# EAGLE board F5529LP_node (EAGLE 7.2.0), part 1 of 2
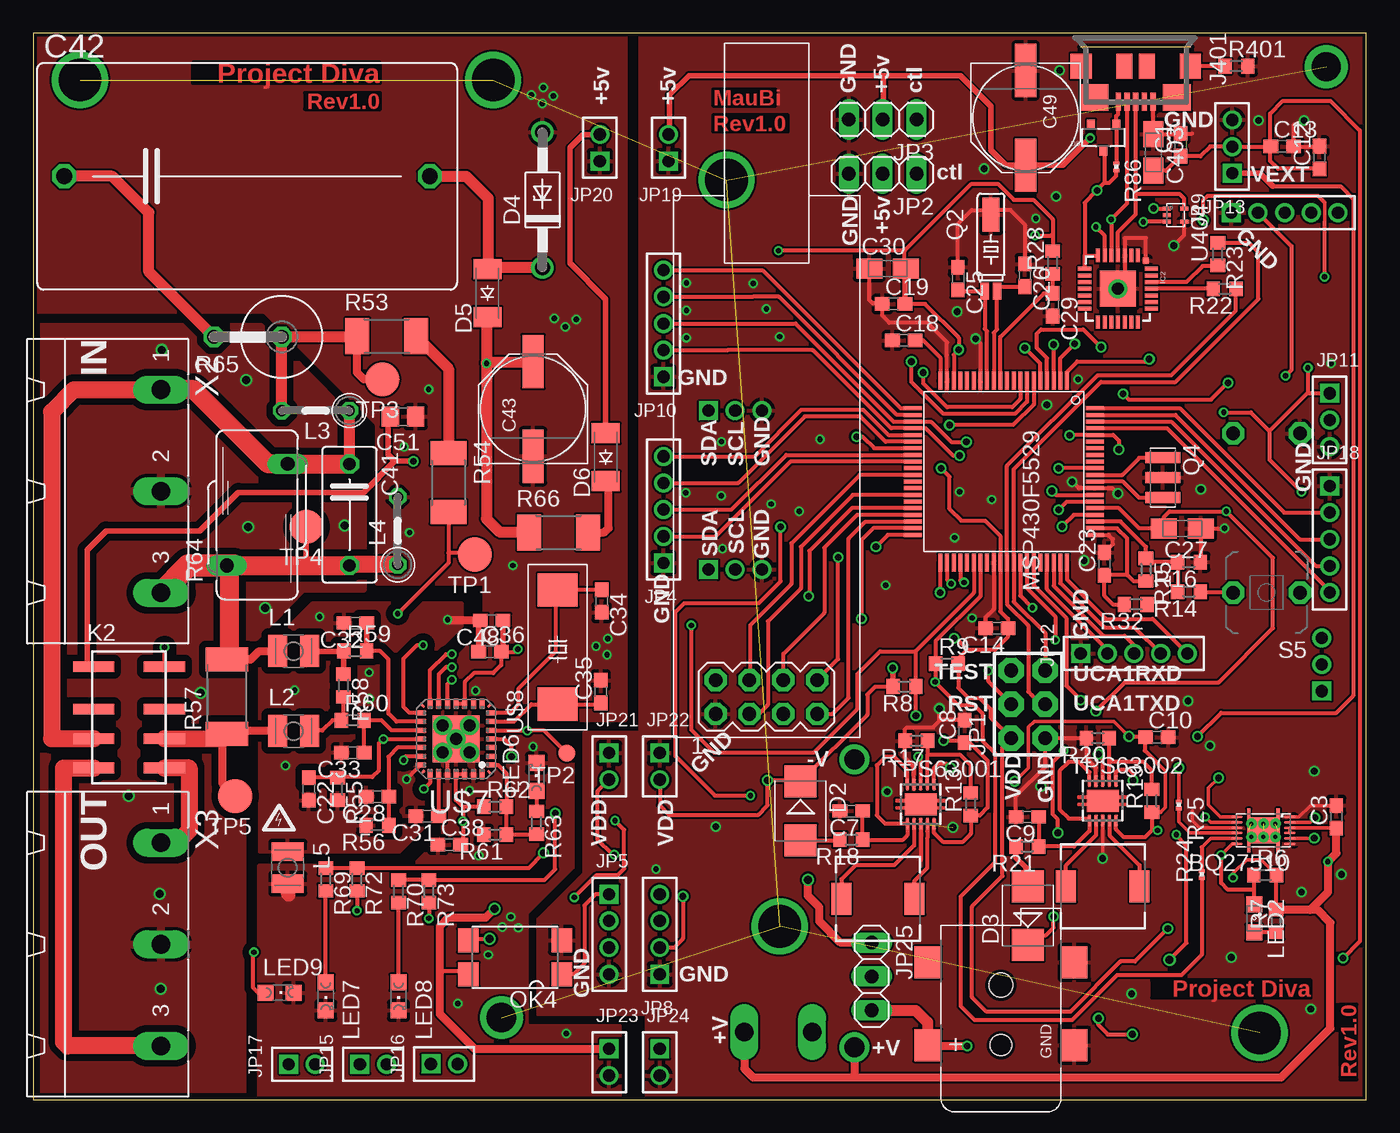
[diagram p2: board, top side]
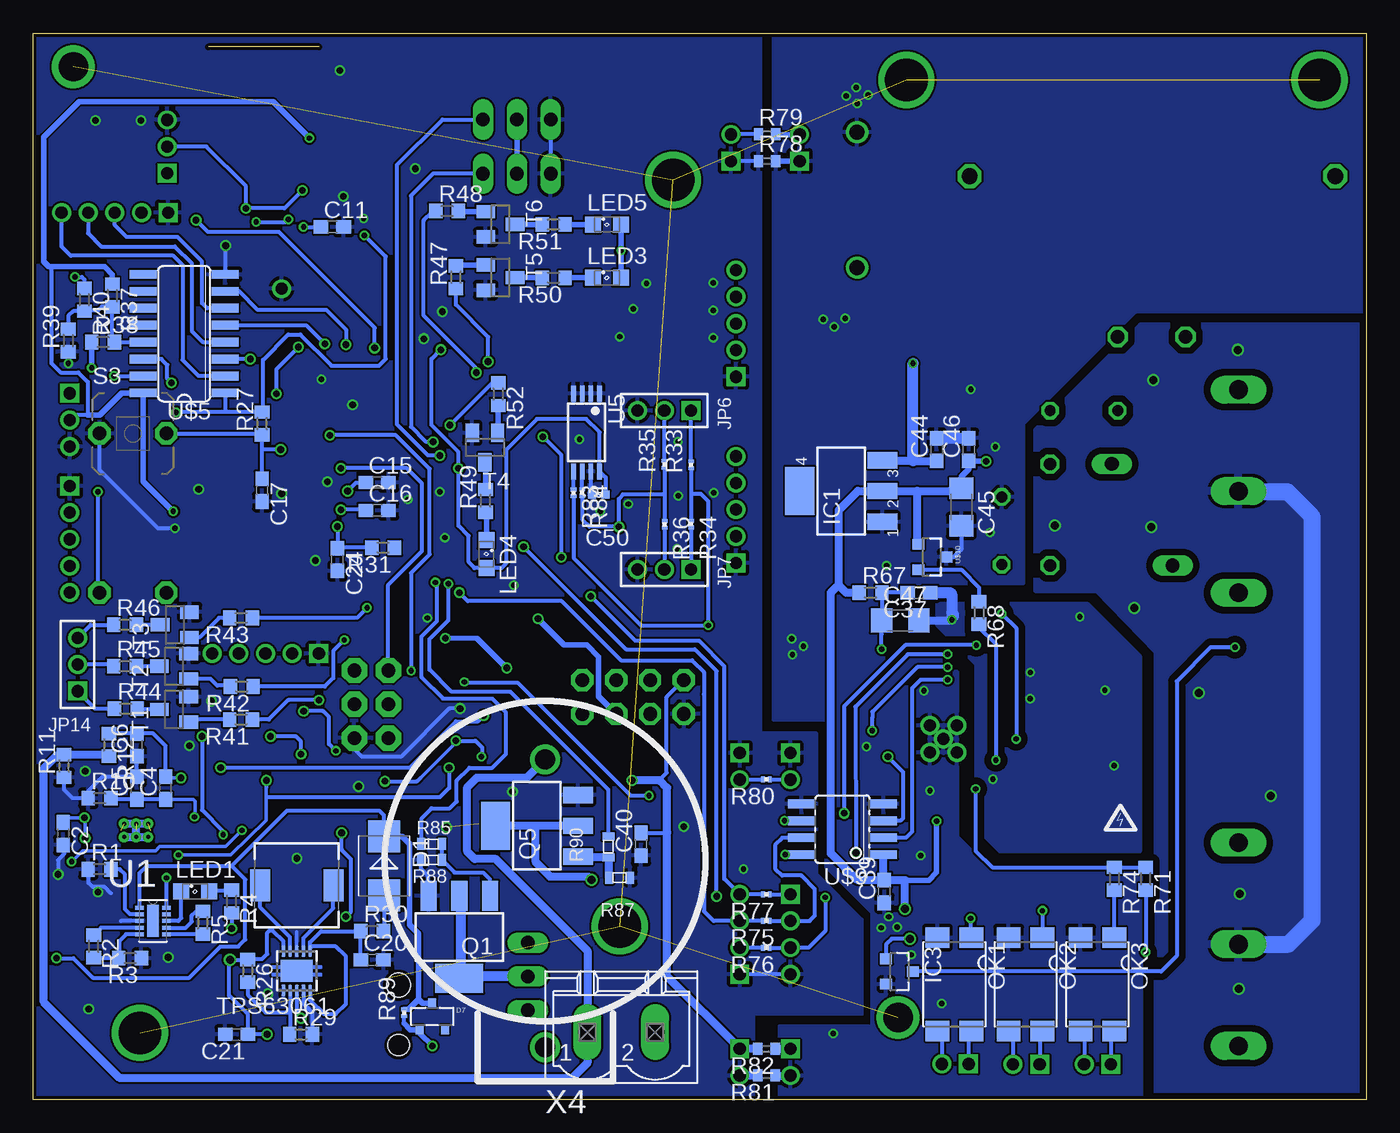
[diagram p3: board, bottom side, seen from below]

Size 100 x 80 mm. Coordinates in mm from the lower left corner, seen from the top.
Outline: 0,0 100,0 100,80 0,80 0,0
Copper layers (1*16): Top 0.035mm / dielectric 1.5mm / Bottom 0.035mm
Design rules "Elecrow_2-layer_eagle_rule": minimum track width 6mil, minimum drill 12mil, track to track 6mil, track to pad 6mil, pad to pad 6mil, via to via 6mil, smd to smd 0mil, copper to edge 10mil, drill to drill 10mil, minimum pad ring 10mil, minimum via ring 6mil, stop-mask expansion 2mil, vias tented up to drill 100mil, thermal gap 10mil
Net classes: 0 default: width 0.254 mm; 1 Ground: width 0.1 mm, drill 0.2 mm; 2 Power: width 0.203 mm, drill 0.305 mm, clearance 0.152 mm to class 0, clearance 0.152 mm to class 1, clearance 0.152 mm

## Footprints (pad centres in the part's own frame; a part is rotated, then mirrored left to right if it is on the bottom)
DRZ = smd 0.85 x 0.2: 1 -1.975,1; 2 -1.975,0.6; 3 -1.975,0.2; 4 -1.975,-0.2; 5 -1.975,-0.6; 6 -1.975,-1; 7 1.975,-1; 8 1.975,-0.6; 9 1.975,-0.2; 10 1.975,0.2; 11 1.975,0.6; 12 1.975,1 | smd 2.45 x 1.95: EXP@1 0,0 | smd 0.25 x 3.3: EXP@2 -1.1,0; EXP@3 1.1,0 | drill 0.3 pad 0.406: EXP@4 -0.9,0.5; EXP@5 0,0.5; EXP@6 0.9,0.5; EXP@7 -0.9,-0.5; EXP@8 0,-0.5; EXP@9 0.9,-0.5
C0603 = smd 1.1 x 1: 1 -0.85,0; 2 0.85,0
A/3216-18R = smd 1.95 x 1.5: + 1.375,0; - -1.375,0
C075-042X103 = drill 0.914 octagon: 1 -3.81,0; 2 3.81,0
C275-173X316 = drill 1.194 octagon: 1 -13.716,0; 2 13.716,0
PANASONIC_F = smd 4 x 1.6: + 3.55,0; - -3.55,0
C1206 = smd 1.6 x 1.8: 1 -1.4,0; 2 1.4,0
0402 = smd 0.6 x 0.6: 1 -0.501,0; 2 0.501,0
C0805 = smd 1.3 x 1.5: 1 -0.95,0; 2 0.95,0
DCJACK_2MM_SMT = smd 2.4 x 2: GND 0,-5.5; GNDBREAK 6.2,-5.5; PWR1 0,5.5; PWR2 6.2,5.5 | hole 1.6: 0,0 | hole 1.8: 4.5,0
DIODE_SMB = smd 2.4 x 2.4: A 2.2,0; C -2.2,0
DO41Z10 = drill 1.118: A 5.08,0; C -5.08,0
SOD-123_MINI-SMA = smd 1.5 x 2.1: A 1.8,0; C -1.8,0
SOT23-R = smd 0.6 x 0.7: 1 -0.95,-1; 2 0.95,-1; 3 0,1
SOT223 = smd 1.219 x 2.235: 1 -2.311,-3.099; 2 0,-3.099; 3 2.311,-3.099 | smd 3.6 x 2.2: 4 0,3.099
MLP28 = smd 1 x 0.3: 1 -2.5,1.5; 2 -2.5,1; 3 -2.5,0.5; 4 -2.5,0; 5 -2.5,-0.5; 6 -2.5,-1; 7 -2.5,-1.5; 15 2.5,-1.5; 16 2.5,-1; 17 2.5,-0.5; 18 2.5,0; 19 2.5,0.5; 20 2.5,1; 21 2.5,1.5 | smd 0.3 x 1: 8 -1.5,-2.5; 9 -1,-2.5; 10 -0.5,-2.5; 11 0,-2.5; 12 0.5,-2.5; 13 1,-2.5; 14 1.5,-2.5; 22 1.5,2.5; 23 1,2.5; 24 0.5,2.5; 25 0,2.5; 26 -0.5,2.5; 27 -1,2.5; 28 -1.5,2.5 | smd 2.7 x 2.7: EXP 0,0 | drill 0.9: EXP@0 0,0 | smd 0.435 x 0.435: M -2.103,2.103
SOT23 = smd 0.8 x 0.9: 1 -0.95,-1; 2 0.95,-1; 3 0,1
HIROSE-ZX62R-B-5P = smd 1.35 x 0.4: D+ 2.675,0; D- 2.675,-0.65; GND 2.675,1.3; NC 2.675,0.65; VBUS 2.675,-1.3 | smd 1.9 x 1.6: SHIELD1 0,4.1; SHIELD2 0,-4.1 | smd 2 x 2.1: SHIELD3 2.35,3.1; SHIELD4 2.35,-3.1 | smd 1.9 x 1.2: SHIELD5 0,0.85; SHIELD6 0,-0.85
2X03 = drill 1.016 pad 1.905 octagon: 1 -2.54,-1.27; 2 -2.54,1.27; 3 0,-1.27; 4 0,1.27; 5 2.54,-1.27; 6 2.54,1.27
1X03 = drill 1.016 long: 1 -2.54,0; 2 0,0; 3 2.54,0
1X05M = drill 0.914 square: 1 -4,0 | drill 0.914: 2 -2,0; 3 0,0; 4 2,0; 5 4,0
1X04M = drill 0.914 square: 1 -3,0 | drill 0.914: 2 -1,0; 3 1,0; 4 3,0
1X03M = drill 0.914 square: 1 -2,0 | drill 0.914: 2 0,0; 3 2,0
1X02M = drill 0.914 square: 1 -1,0 | drill 0.914: 2 1,0
FTR-B4G = smd 0.8 x 3.1: 1 -3.8,-2.65; 2 -0.6,-2.65; 3 1.6,-2.65; 4 3.8,-2.65; 5 3.8,2.65; 6 1.6,2.65; 7 -0.6,2.65; 8 -3.8,2.65
L2825P = smd 1.4 x 2.4: 1 -1.2,0; 2 1.2,0
0207/5V = drill 0.813 octagon: 1 -2.54,0; 2 2.54,0
SML0805 = smd 1.2 x 1.2: A 1.05,0; C -1.05,0
CHIPLED_0805 = smd 1.2 x 1.2: A 0,-1.05; C 0,1.05
PN80 = smd 1.35 x 0.3: 1 -6.825,4.75; 2 -6.825,4.25; 3 -6.825,3.75; 4 -6.825,3.25; 5 -6.825,2.75; 6 -6.825,2.25; 7 -6.825,1.75; 8 -6.825,1.25; 9 -6.825,0.75; 10 -6.825,0.25; 11 -6.825,-0.25; 12 -6.825,-0.75; 13 -6.825,-1.25; 14 -6.825,-1.75; 15 -6.825,-2.25; 16 -6.825,-2.75; 17 -6.825,-3.25; 18 -6.825,-3.75; 19 -6.825,-4.25; 20 -6.825,-4.75; 41 6.825,-4.75; 42 6.825,-4.25; 43 6.825,-3.75; 44 6.825,-3.25; 45 6.825,-2.75; 46 6.825,-2.25; 47 6.825,-1.75; 48 6.825,-1.25; 49 6.825,-0.75; 50 6.825,-0.25; 51 6.825,0.25; 52 6.825,0.75; 53 6.825,1.25; 54 6.825,1.75; 55 6.825,2.25; 56 6.825,2.75; 57 6.825,3.25; 58 6.825,3.75; 59 6.825,4.25; 60 6.825,4.75 | smd 0.3 x 1.35: 21 -4.75,-6.825; 22 -4.25,-6.825; 23 -3.75,-6.825; 24 -3.25,-6.825; 25 -2.75,-6.825; 26 -2.25,-6.825; 27 -1.75,-6.825; 28 -1.25,-6.825; 29 -0.75,-6.825; 30 -0.25,-6.825; 31 0.25,-6.825; 32 0.75,-6.825; 33 1.25,-6.825; 34 1.75,-6.825; 35 2.25,-6.825; 36 2.75,-6.825; 37 3.25,-6.825; 38 3.75,-6.825; 39 4.25,-6.825; 40 4.75,-6.825; 61 4.75,6.825; 62 4.25,6.825; 63 3.75,6.825; 64 3.25,6.825; 65 2.75,6.825; 66 2.25,6.825; 67 1.75,6.825; 68 1.25,6.825; 69 0.75,6.825; 70 0.25,6.825; 71 -0.25,6.825; 72 -0.75,6.825; 73 -1.25,6.825; 74 -1.75,6.825; 75 -2.25,6.825; 76 -2.75,6.825; 77 -3.25,6.825; 78 -3.75,6.825; 79 -4.25,6.825; 80 -4.75,6.825
NRF24L01_HP = drill 1.016 pad 1.676 octagon: 1 13.485,-5.74; 2 10.945,-5.74; 3 13.485,-3.2; 4 10.945,-3.2; 5 13.485,-0.66; 6 10.945,-0.66; 7 13.485,1.88; 8 10.945,1.88
SMD4 = smd 1.78 x 1.55: 1 -1.27,-3.5; 2 1.27,-3.5; 3 1.27,3.5; 4 -1.27,3.5
MS3V-T1R = smd 0.635 x 1.27: P1 -0.47,-4.43; P2 0.47,-4.43 | smd 1.27 x 2.54: P3 0,1.3
MURATA-FILTER_CSTCR = smd 0.8 x 2.6: 1 -1.5,0; 2 0,0; 3 1.5,0
R0603 = smd 1 x 1.1: 1 -0.85,0; 2 0.85,0
R0201 = smd 0.28 x 0.43: 1 -0.255,0; 2 0.255,0
R2010 = smd 1.8 x 2.7: 1 -2.2,0; 2 2.2,0
R2512 = smd 1.8 x 3.2: 1 -2.8,0; 2 2.8,0
S10K420 = drill 1.016 long: 1 -2.286,-3.81; 2 2.286,3.81
0617V = drill 1.016 octagon: 1 -2.54,0; 2 2.54,0
R0402 = smd 0.7 x 0.9: 1 -0.65,0; 2 0.65,0
0603 = smd 0.6 x 0.9: 1 -0.787,0; 2 0.787,0
PBTH = drill 1.016 pad 1.676 octagon: 1 -0.001,0.001; 2 5.001,0.001
SOT23' = smd 1 x 1.4: 1 -0.95,-1.1; 2 0.95,-1.1; 3 0,1.1
B2,54 = smd 2.54 x 2.54: TP 0,0
B1,27 = smd 1.27 x 1.27: TP 0,0
DRC-S-PVSON-N10 = smd 0.28 x 0.85: 1 -1,-1.475; 2 -0.5,-1.475; 3 0,-1.475; 4 0.5,-1.475; 5 1,-1.475; 6 1,1.475; 7 0.5,1.475; 8 0,1.475; 9 -0.5,1.475; 10 -1,1.475 | smd 2.4 x 1.65: TH 0,0
SON50P200X300X80-11N = smd 0.66 x 0.305: 1 -1.016,0.991; 2 -1.016,0.508; 3 -1.016,0; 4 -1.016,-0.508; 5 -1.016,-0.991; 6 1.016,-0.991; 7 1.016,-0.508; 8 1.016,0; 9 1.016,0.508; 10 1.016,0.991 | smd 0.838 x 2.388: 11 0,0
TSSOP8 = smd 1.2 x 0.35: 1 -2.925,0.975; 2 -2.925,0.325; 3 -2.925,-0.325; 4 -2.925,-0.975; 5 2.925,-0.975; 6 2.925,-0.325; 7 2.925,0.325; 8 2.925,0.975
TPD2E001-DRL = smd 0.3 x 0.6: 1 -0.5,-0.65; 2 0,-0.65; 3 0.5,-0.65; 4 0.5,0.65; 5 -0.5,0.65
CR2032 = drill 1.5: P$1 0,-13.97; P$2 0,7.62
B82462G = smd 2.4 x 1.5: P$1 0,2.75; P$2 0,-2.75
SOIC16 = smd 0.66 x 2.032: 1 -4.445,-3.073; 2 -3.175,-3.073; 3 -1.905,-3.073; 4 -0.635,-3.073; 5 0.635,-3.073; 6 1.905,-3.073; 7 3.175,-3.073; 8 4.445,-3.073; 9 4.445,3.073; 10 3.175,3.073; 11 1.905,3.073; 12 0.635,3.073; 13 -0.635,3.073; 14 -1.905,3.073; 15 -3.175,3.073; 16 -4.445,3.073
QFN28 = smd 0.8 x 0.4: 1 -2.65,1.95; 2 -2.65,1.3; 3 -2.65,0.65; 4 -2.65,0; 5 -2.65,-0.65; 6 -2.65,-1.3; 7 -2.65,-1.95; 15 2.65,-1.95; 16 2.65,-1.3; 17 2.65,-0.65; 18 2.65,0; 19 2.65,0.65; 20 2.65,1.3; 21 2.65,1.95 | smd 0.4 x 0.8: 8 -1.95,-2.65; 9 -1.3,-2.65; 10 -0.65,-2.65; 11 0,-2.65; 12 0.65,-2.65; 13 1.3,-2.65; 14 1.95,-2.65; 22 1.95,2.65; 23 1.3,2.65; 24 0.65,2.65; 25 0,2.65; 26 -0.65,2.65; 27 -1.3,2.65; 28 -1.95,2.65 | smd 3.55 x 3.55: M@0 0,0 | drill 0.9: M@1 -1.016,1.016; M@2 1.016,1.016; M@3 -1.016,-1.016; M@4 1.016,-1.016; M@5 0,0 | smd 0.17 x 0.4 rotated 45: R1 -2.525,2.525 | smd 0.17 x 0.4 rotated 135: R2 -2.525,-2.525 | smd 0.17 x 0.4 rotated 225: R3 2.525,-2.525 | smd 0.17 x 0.4 rotated 315: R4 2.5,2.5
FQ1045A = smd 2.5 x 3: 1 -4.128,0; 2 4.445,0
SOIC08 = smd 0.66 x 2.032: 1 -1.905,-3.073; 2 -0.635,-3.073; 3 0.635,-3.073; 4 1.905,-3.073; 5 1.905,3.073; 6 0.635,3.073; 7 -0.635,3.073; 8 -1.905,3.073
SOT23-3 = smd 0.8 x 0.9: 1 -0.95,-1; 2 0.95,-1; 3 0,1.1
GMSTBA3 = drill 1.397 long: 1 -7.62,5.08; 2 0,5.08; 3 7.62,5.08
MSTBV2 = drill 1.397 long: 1 -2.54,0; 2 2.54,0

## Placement (x,y rotation side)
BQ27510  BQ27510-G3  [DRZ]  92.3,20.19 180 top
C1  100n  [C0603]  86.07,71.63 90 top
C2  0.47u  [C0603]  97.76,19.94 270 bottom
C3  0.47u  [C0603]  97.76,21.21 90 top
C4  0.47u  [C0603]  90.07,23.37 90 bottom
C5  0.47u  [C0603]  92.23,23.37 90 bottom
C6  0.47u  [C0603]  92.23,26.61 90 bottom
C7  0.47u  [C0603]  61.37,21.65 180 top
C8  0.47u  [C0603]  69.88,27.62 90 top
C9  0.47u  [C0603]  74.58,21.21 180 top
C10  0.47u  [C0603]  84.3,27.18 0 top
C11  0.1u  [C0603]  77.56,65.47 0 bottom
C12  1u  [C0603]  96.49,70.68 90 top
C13  0.1u  [C0603]  93.69,71.5 0 top
C14  100n  [C0603]  72.29,35.37 180 top
C15  220n  [C0603]  74.2,46.29 0 bottom
C16  220n  [C0603]  74.2,44.2 0 bottom
C17  1n  [C0603]  82.84,45.72 270 bottom
C18  470n  [C0603]  65.31,56.96 0 top
C19  100n  [C0603]  64.55,59.69 0 top
C20  0.47u  [C0603]  74.58,10.48 0 bottom
C21  0.47u  [C0603]  84.74,4.89 180 bottom
C22  0.1uF  [C0603]  20.67,23.3 270 top
C23  10p  [C0603]  80.36,40.2 90 top
C24  10p  [C0603]  77.18,40.51 270 bottom
C25  12p  [C0603]  69.37,61.59 270 top
C26  12p  [C0603]  74.39,61.85 270 top
C27  4u7  [A/3216-18R]  86.2,42.86 180 top
C28  33nF 50V  [C0603]  25.81,22.73 180 top
C29  100n  [C0603]  76.49,59.63 270 top
C30  10u  [A/3216-18R]  64.1,62.36 0 top
C31  0.1uF  [C0603]  29.56,21.27 180 top
C32  33nF 50V  [C0603]  24.16,35.75 180 top
C33  33nF 50V  [C0603]  23.97,26.04 180 top
C34  18pF  [C0603]  42.64,37.4 270 top
C35  18pF  [C0603]  42.58,30.61 90 top
C36  0.1uF  [C0603]  34.26,33.59 0 top
C37  0.1uF  [C0603]  33.56,38.04 180 bottom
C38  0.1uF  [C0603]  31.21,19.11 0 top
C39  0.1uF  [C0603]  36.15,15.61 90 bottom
C40  0.1uF  [C0603]  54.4,19.15 90 bottom
C41  B32911A3103M  [C075-042X103]  23.72,43.88 270 top
C42  ECQ-U2A155ML  [C275-173X316]  16.03,69.28 0 top
C43  [PANASONIC_F]  37.5,51.82 90 top
C44  0.1uF  [C0603]  32.23,48.77 90 bottom
C45  10uF  [C1206]  30.38,44.45 270 bottom
C46  0.1uF  [C0603]  29.81,48.77 90 bottom
C47  10uF  [C1206]  34.96,35.94 0 bottom
C48  0.1uF  [C0603]  34.38,35.94 180 top
C49  [PANASONIC_F]  74.45,73.66 270 top
C50  100n  [0402]  57.56,45.38 180 bottom
C51  0.1uF  [C0805]  27.73,51.23 180 top
C403  4u7  [A/3216-18R]  84.04,71.06 270 top
CN1  [DCJACK_2MM_SMT]  72.6,4.08 90 top
D1  [DIODE_SMB]  73.69,17.53 270 bottom
D2  [DIODE_SMB]  57.56,21.65 270 top
D3  [DIODE_SMB]  74.62,13.79 90 top
D4  1N4728  [DO41Z10]  38.2,67.5 90 top
D5  CGRM4005-G  [SOD-123_MINI-SMA]  34.07,60.52 90 top
D6  CGRM4005-G  [SOD-123_MINI-SMA]  42.94,48.2 90 top
D7  [SOT23-R]  70.07,6.24 0 bottom
D8  [SOT23-R]  80.3,72.17 180 top
IC1  [SOT223]  39.4,45.66 90 bottom
IC2  CP210X_USB_UART  [MLP28]  81.38,60.83 270 top
IC3  MDC3105LT1  [SOT23]  35.02,9.6 270 bottom
J401  [HIROSE-ZX62R-B-5P]  82.71,77.53 270 top
JP1  [2X03]  74.64,29.65 90 top
JP2  [1X03]  63.72,69.47 180 top
JP3  [1X03]  63.72,73.53 180 top
JP4  [1X05M]  47.28,44.26 90 top
JP5  [1X04M]  43.2,12.4 270 top
JP6  [1X03M]  52.66,51.69 180 bottom
JP7  [1X03M]  52.66,39.76 180 bottom
JP8  [1X04M]  47,12.4 90 top
JP9  [1X05M]  93.88,66.55 0 top
JP10  [1X05M]  47.28,58.23 90 top
JP11  [1X03M]  97.26,50.99 270 top
JP12  [1X05M]  82.58,33.46 0 top
JP13  [1X03M]  89.95,71.5 90 top
JP14  [1X03M]  96.68,32.64 90 bottom
JP15  [1X02M]  25.5,2.65 0 top
JP16  [1X02M]  30.83,2.67 0 top
JP17  [1X02M]  20.16,2.65 0 top
JP18  [1X05M]  97.26,42.04 270 top
JP19  [1X02M]  47.66,71.41 90 top
JP20  [1X02M]  42.5,71.41 90 top
JP21  [1X02M]  43.2,25 270 top
JP22  [1X02M]  47,25 270 top
JP23  [1X02M]  43.2,2.8 270 top
JP24  [1X02M]  47,2.8 270 top
JP25  [1X03]  62.9,9.23 270 top
K2  FTR-B4G  [FTR-B4G]  7.18,28.68 270 top
L1  800mA 150mOhm  [L2825P]  19.54,33.65 0 top
L2  LI0805H151R-10  [L2825P]  19.54,27.64 0 top
L3  [0207/5V]  21.18,51.69 180 top
L4  [0207/5V]  27.34,42.67 90 top
L5  [L2825P]  19.08,17.4 270 top
LED1  [SML0805]  87.85,15.62 0 bottom
LED2  [SML0805]  91.6,13.59 270 top
LED3  [SML0805]  56.96,61.66 0 bottom
LED4  [SML0805]  66.01,40.92 270 bottom
LED5  [SML0805]  56.96,65.66 0 bottom
LED6  [CHIPLED_0805]  37.75,24.19 0 top
LED7  [CHIPLED_0805]  21.94,7.74 180 top
LED8  [CHIPLED_0805]  27.4,7.74 180 top
LED9  [CHIPLED_0805]  18.48,8.01 270 top
MSP430F5529  MSP430F5529IPNR  [PN80]  72.8,47.12 270 top
NRF24L01  NRF24L01HP  [NRF24L01_HP]  56.93,42.42 270 top
OK1  LTV816S  [SMD4]  30.89,8.64 180 bottom
OK2  LTV816S  [SMD4]  25.56,8.64 180 bottom
OK3  LTV816S  [SMD4]  20.16,8.64 180 bottom
OK4  LTV816S  [SMD4]  36.14,10.67 90 top
Q1  N-HEXFET-2D_SOT232-IRLL2705  [SOT223]  68.04,12.19 180 bottom
Q2  32.768kHz  [MS3V-T1R]  71.85,65.09 0 top
Q4  CSTCR4M00G15L99  [MURATA-FILTER_CSTCR]  84.74,46.67 270 top
Q5  N-HEXFET-2D_SOT232-IRLL2705  [SOT223]  62.22,20.54 90 bottom
R1  1.6k  [R0603]  95.03,17.27 0 bottom
R2  20k  [R0603]  95.47,11.49 270 bottom
R3  10k  [R0603]  92.74,10.6 180 bottom
R4  1k  [R0603]  85.12,14.86 270 bottom
R5  10k  [R0603]  87.28,13.27 270 bottom
R6  10k  [R0603]  92.42,16.83 0 top
R7  1k  [R0603]  93.25,13.4 90 top
R8  10k  [R0603]  65.37,30.99 180 top
R9  10k  [R0603]  68.55,32.7 0 top
R10  100  [R0603]  95.03,22.61 0 bottom
R11  0.01  [R0603]  97.69,25.02 90 bottom
R12  100  [R0603]  94.33,26.61 270 bottom
R13  10k  [R0603]  70.33,22.16 90 top
R14  100R  [R0603]  86.71,38.1 180 top
R15  1k4  [R0603]  83.47,39.75 270 top
R16  1M  [R0603]  86.71,40.32 180 top
R17  ONP  [R0603]  66.26,26.92 180 top
R18  0  [R0603]  61.37,19.49 180 top
R19  10k  [R0603]  83.92,22.42 90 top
R20  ONP  [R0603]  79.85,27.11 180 top
R21  0  [R0603]  74.58,18.99 180 top
R22  0  [R0603]  89.38,60.83 180 top
R23  0  [R0603]  88.87,63.44 270 top
R24  0  [R0201]  87.66,16.89 90 top
R25  0  [R0201]  85.95,22.1 270 top
R26  10k  [R0603]  83.92,9.65 270 bottom
R27  47k  [R0603]  82.84,50.74 90 bottom
R28  0R  [R0603]  76.49,62.8 90 top
R29  ONP  [R0603]  79.91,4.89 0 bottom
R30  0  [R0603]  74.58,12.64 0 bottom
R31  27R  [R0603]  73.75,41.4 180 bottom
R32  27R  [R0603]  82.71,37.15 180 top
R33  0  [R0201]  50.64,47.62 90 bottom
R34  0  [R0201]  50.64,43.18 270 bottom
R35  0  [R0201]  52.66,47.66 90 bottom
R36  0  [R0201]  52.63,43.15 270 bottom
R37  0  [R0603]  94.08,60.33 270 bottom
R38  0  [R0603]  94.77,56.83 0 bottom
R39  0  [R0603]  97.38,56.96 90 bottom
R40  0  [R0603]  96.17,60.01 270 bottom
R41  270  [R0603]  84.42,28.51 180 bottom
R42  270  [R0603]  84.36,30.99 180 bottom
R43  270  [R0603]  84.42,36.13 180 bottom
R44  0  [R0603]  93.06,29.34 0 bottom
R45  0  [R0603]  93.12,32.51 0 bottom
R46  0  [R0603]  93.12,35.62 0 bottom
R47  270  [R0603]  68.29,61.69 90 bottom
R48  270  [R0603]  68.96,66.67 0 bottom
R49  0  [R0603]  66.07,44.92 90 bottom
R50  0  [R0603]  60.96,61.66 180 bottom
R51  0  [R0603]  60.96,65.66 180 bottom
R52  270  [R0603]  65.12,52.92 270 bottom
R53  499k 1%  [R2010]  26.51,57.28 0 top
R54  499k 1%  [R2010]  31.15,46.29 270 top
R55  1k 1%  [R0603]  22.83,23.3 270 top
R56  1k 1%  [R0603]  25.81,20.57 180 top
R57  Shunt 2mOhm  [R2512]  14.54,30.21 90 top
R58  2.49 1% DNP  [R0603]  23.27,31.05 270 top
R59  1k 1%  [R0603]  24.16,33.66 0 top
R60  1k 1%  [R0603]  23.97,28.45 0 top
R61  4k7 1%  [R0603]  34.64,19.88 180 top
R62  nc  [R0603]  34.64,21.97 0 top
R63  1k 5%  [R0603]  37.75,20.76 270 top
R64  S10K420  [S10K420]  16.8,43.88 0 top
R65  33Ohm 45F33RE-ND  [0617V]  16.1,57.21 180 top
R66  NC  [R2010]  39.4,42.55 0 top
R67  100  [R0603]  37.18,38.04 0 bottom
R68  NC  [R0603]  29.05,36.51 270 bottom
R69  1k 5%  [R0603]  21.94,16.51 270 top
R70  1k 5%  [R0603]  27.4,15.62 270 top
R71  1k 5%  [R0603]  16.54,16.57 270 bottom
R72  3.3k 5%  [R0603]  24.29,16.51 270 top
R73  3.3k 5%  [R0603]  29.69,15.62 270 top
R74  3.3k 5%  [R0603]  18.89,16.57 270 bottom
R75  RX  [R0201]  45,13.41 180 bottom
R76  TX  [R0201]  45,11.38 180 bottom
R77  RELAY  [R0201]  45,15.39 180 bottom
R78  GNDA  [R0402]  44.95,70.42 0 bottom
R79  5V  [R0402]  44.95,72.42 0 bottom
R80  VDD  [R0201]  45,24.02 180 bottom
R81  GND  [R0402]  45,1.8 180 bottom
R82  3.3v  [R0402]  45,3.8 180 bottom
R83  0  [R0201]  59.47,45.52 270 bottom
R84  0  [R0201]  58.82,45.53 270 bottom
R85  10k  [0603]  70.12,17.98 0 bottom
R86  VDD  [R0201]  81.25,69.98 270 top
R87  10k  [0603]  56.01,16.64 180 bottom
R88  470R  [0603]  70.12,19.18 180 bottom
R89  VDD  [R0201]  72.18,6.52 90 bottom
R90  470R  [0603]  56.85,18.97 90 bottom
R401  33R  [R0603]  90.27,77.53 0 top
S3  RST  [PBTH]  95.03,49.97 0 bottom
S5  BSL  [PBTH]  95.03,38.04 180 top
T1  BC847  [SOT23']  89.44,29.27 90 bottom
T2  BC847  [SOT23']  89.44,32.51 90 bottom
T3  BC847  [SOT23']  89.38,35.62 90 bottom
T4  BC847  [SOT23']  66.12,48.92 180 bottom
T5  BC847  [SOT23']  64.96,61.67 270 bottom
T6  BC847  [SOT23']  64.96,65.67 270 bottom
TP1  TPB2,54  [B2,54]  33.11,40.89 180 top
TP2  TPB1,27  [B1,27]  40.04,25.97 180 top
TP3  TPB2,54  [B2,54]  26.19,54.04 180 top
TP4  TPB2,54  [B2,54]  20.48,42.99 180 top
TP5  TPB2,54  [B2,54]  15.14,22.77 180 top
TPS63001  TPS6300  [DRC-S-PVSON-N10]  66.58,22.16 0 top
TPS63002  TPS6300  [DRC-S-PVSON-N10]  80.23,22.42 0 top
TPS63061  TPS6300  [DRC-S-PVSON-N10]  80.23,9.65 180 bottom
U1  BQ24210DQCT  [SON50P200X300X80-11N]  91.03,13.4 0 bottom
U5  CAT24FC32UI  [TSSOP8]  58.49,50.05 270 bottom
U404  TPD2E001DRLR  [TPD2E001-DRL]  85.69,66.36 270 top
U$1  CR2032  [CR2032]  61.6,17.89 0 bottom
U$3  [B82462G]  63.37,15.06 270 top
U$4  [B82462G]  80.23,16 270 top
U$5  CD4504B  [SOIC16]  88.68,57.47 90 bottom
U$6  [B82462G]  80.23,16.07 90 bottom
U$7  MCP39F501  [QFN28]  31.72,27.05 180 top
U$8  FQ1045A  [FQ1045A]  39.34,33.78 90 top
U$9  IL712  [SOIC08]  39.29,20.28 90 bottom
U$10  MCP9700SMD  [SOT23-3]  32.61,40.7 270 bottom
U$11  HIGH_VOLTAGE  [HIGH_VOLTAGE]  19.58,20.23 0 bottom
U$12  HIGH_VOLTAGE  [HIGH_VOLTAGE]  17.29,20.24 0 top
X2  GMSTBA3  [GMSTBA3]  4.5,45.65 270 top
X3  GMSTBA3  [GMSTBA3]  4.5,11.64 270 top
X4  MSTBV2  [MSTBV2]  55.89,5.05 0 bottom